# EAGLE board uNimbus_board_2_v1_2 (EAGLE 9.3.1)
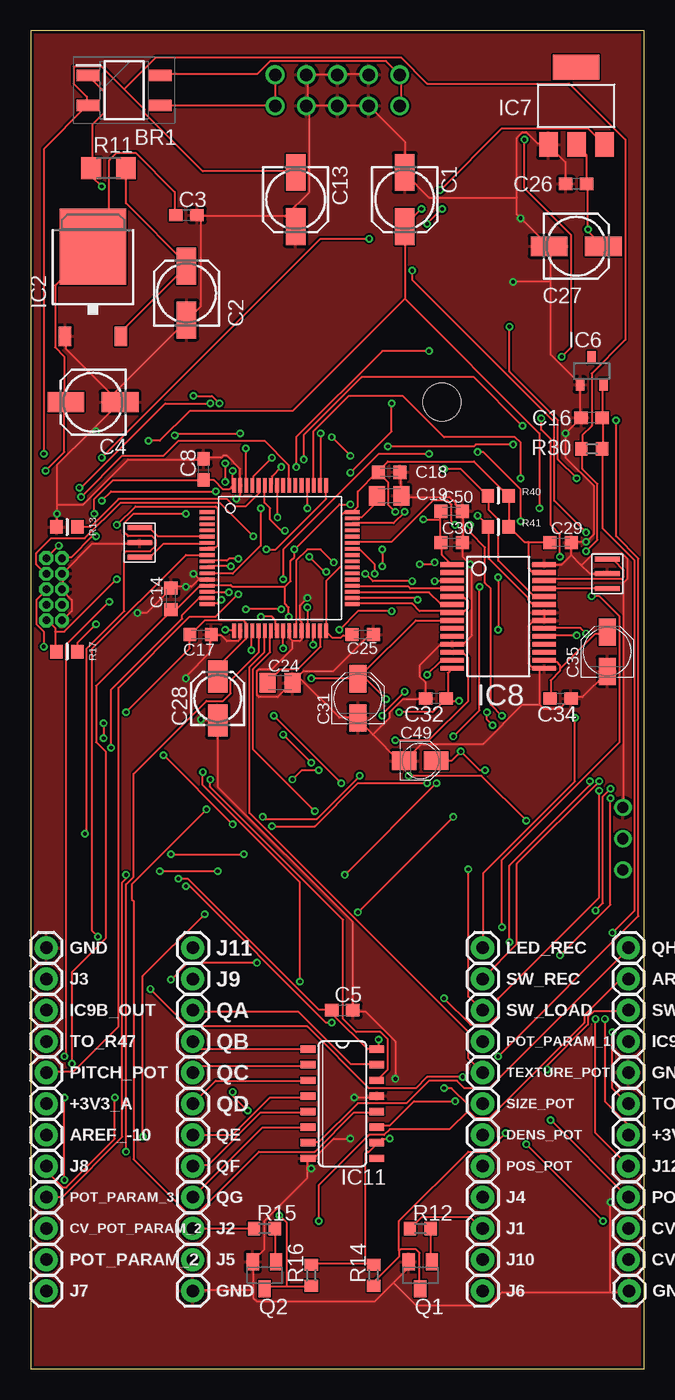
[diagram p4: board, top side]
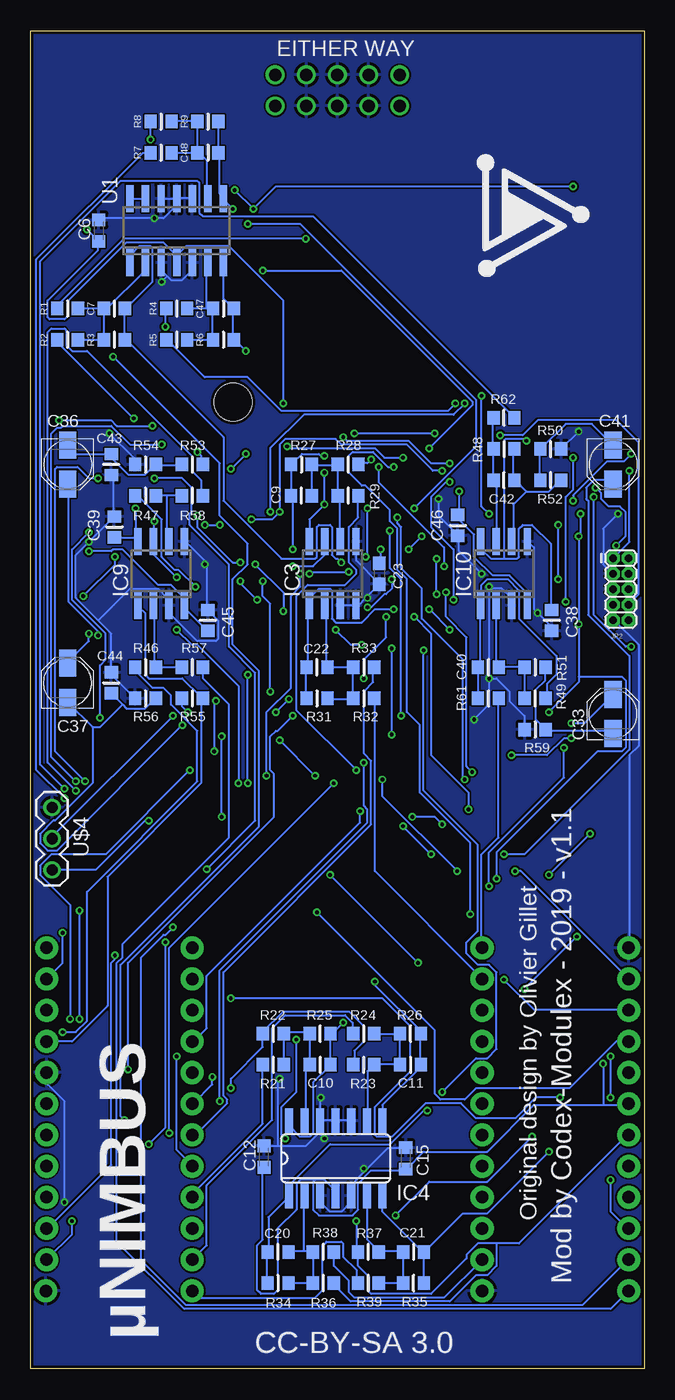
[diagram p5: board, bottom side, seen from below]

Size 50 x 109 mm. Coordinates in mm from the lower left corner, seen from the top.
Outline: 0,0 50,0 50,109 0,109 0,0
Copper layers (1*16): Top 0.035mm / dielectric 1.5mm / Bottom 0.035mm
Design rules "dirt_cheap_dirty_boards.v1.1": minimum track width 6mil, minimum drill 12mil, track to track 6mil, track to pad 6mil, pad to pad 6mil, via to via 6mil, smd to smd 0mil, copper to edge 10mil, drill to drill 10mil, minimum pad ring 10mil, minimum via ring 6mil, stop-mask expansion 2mil, vias tented up to drill 25mil, thermal gap 10mil
Holes 3.1 mm at 33.51,78.74

## Footprints (pad centres in the part's own frame; a part is rotated, then mirrored left to right if it is on the bottom)
SOP245P670X290-4N = smd 1.925 x 0.95: 1 -2.912,1.225; 2 -2.912,-1.225; 3 2.912,-1.225; 4 2.912,1.225
153CLV-0505 = smd 3 x 1.6: + 2.2,0; - -2.2,0
C0603 = smd 1.1 x 1: 1 -0.85,0; 2 0.85,0
C0603K = smd 1.05 x 1.08: 1 -0.875,0; 2 0.875,0
PARTS_AMAN_RESISTOR_0603 = smd 1 x 1.1: 1 -0.85,0; 2 0.85,0
C0805K = smd 1.3 x 1.6: 1 -1,0; 2 1,0
153CLV-0405 = smd 2.6 x 1.6: + 1.8,0; - -1.8,0
PANASONIC_B = smd 2.2 x 1.4: + 1.6,0; - -1.6,0
PANASONIC_A = smd 2 x 1.5: + 1.3,0; - -1.3,0
TO252 = smd 1 x 1.6: 1 -2.28,-4.8; 2 2.28,-4.8 | smd 5.4 x 6.2: 3 0,2.5
SO08 = smd 0.6 x 2.2: 1 -1.905,-2.6; 2 -0.635,-2.6; 3 0.635,-2.6; 4 1.905,-2.6; 5 1.905,2.6; 6 0.635,2.6; 7 -0.635,2.6; 8 -1.905,2.6
SO14 = smd 0.66 x 2.032: 1 -3.81,-3.073; 2 -2.54,-3.073; 3 -1.27,-3.073; 4 0,-3.073; 5 1.27,-3.073; 6 2.54,-3.073; 7 3.81,-3.073; 8 3.81,3.073; 9 2.54,3.073; 10 1.27,3.073; 11 0,3.073; 12 -1.27,3.073; 13 -2.54,3.073; 14 -3.81,3.073
TQFP-10X10-64 = smd 1.2 x 0.3: 1 -5.936,3.75; 2 -5.936,3.25; 3 -5.936,2.75; 4 -5.936,2.25; 5 -5.936,1.75; 6 -5.936,1.25; 7 -5.936,0.75; 8 -5.936,0.25; 9 -5.936,-0.25; 10 -5.936,-0.75; 11 -5.936,-1.25; 12 -5.936,-1.75; 13 -5.936,-2.25; 14 -5.936,-2.75; 15 -5.936,-3.25; 16 -5.936,-3.75; 33 5.886,-3.75; 34 5.886,-3.25; 35 5.886,-2.75; 36 5.886,-2.25; 37 5.886,-1.75; 38 5.886,-1.25; 39 5.886,-0.75; 40 5.886,-0.25; 41 5.886,0.25; 42 5.886,0.75; 43 5.886,1.25; 44 5.886,1.75; 45 5.886,2.25; 46 5.886,2.75; 47 5.886,3.25; 48 5.886,3.75 | smd 0.3 x 1.2: 17 -3.75,-5.911; 18 -3.25,-5.911; 19 -2.75,-5.911; 20 -2.25,-5.911; 21 -1.75,-5.911; 22 -1.25,-5.911; 23 -0.75,-5.911; 24 -0.25,-5.911; 25 0.25,-5.911; 26 0.75,-5.911; 27 1.25,-5.911; 28 1.75,-5.911; 29 2.25,-5.911; 30 2.75,-5.911; 31 3.25,-5.911; 32 3.75,-5.911; 49 3.75,5.936; 50 3.25,5.936; 51 2.75,5.936; 52 2.25,5.936; 53 1.75,5.936; 54 1.25,5.936; 55 0.75,5.936; 56 0.25,5.936; 57 -0.25,5.936; 58 -0.75,5.936; 59 -1.25,5.936; 60 -1.75,5.936; 61 -2.25,5.936; 62 -2.75,5.936; 63 -3.25,5.936; 64 -3.75,5.936
DBZ_R-PDSO-G3 = smd 0.7 x 1: 1 -0.95,-1.1; 2 0.95,-1.1; 3 0,1.1
SOT223 = smd 1.499 x 2.007: 1 -2.261,-3.15; 2 0.025,-3.15; 3 2.311,-3.15 | smd 3.81 x 2.007: 4 0,3.15
SSOP28 = smd 0.381 x 1.905: 1 -4.55,-3.752; 2 -3.9,-3.752; 3 -3.25,-3.752; 4 -2.6,-3.752; 5 -1.95,-3.752; 6 -1.3,-3.752; 7 -0.65,-3.752; 8 0,-3.752; 9 0.65,-3.752; 10 1.3,-3.752; 11 1.95,-3.752; 12 2.6,-3.752; 13 3.25,-3.752; 14 3.9,-3.752; 15 3.9,3.752; 16 3.25,3.752; 17 2.6,3.752; 18 1.95,3.752; 19 1.3,3.752; 20 0.65,3.752; 21 0,3.752; 22 -0.65,3.752; 23 -1.3,3.752; 24 -1.95,3.752; 25 -2.6,3.752; 26 -3.25,3.752; 27 -3.9,3.752; 28 -4.55,3.752
SO16 = smd 0.6 x 1.2: 1 -4.445,-2.8; 2 -3.175,-2.8; 3 -1.905,-2.8; 4 -0.635,-2.8; 5 0.635,-2.8; 6 1.905,-2.8; 7 3.175,-2.8; 8 4.445,-2.8; 9 4.445,2.8; 10 3.175,2.8; 11 1.905,2.8; 12 0.635,2.8; 13 -0.635,2.8; 14 -1.905,2.8; 15 -3.175,2.8; 16 -4.445,2.8
PARTS_AMAN_1X01 = drill 1.016 pad 1.88: 1 0,0
2X5-1.27 = drill 0.61 pad 1.067 octagon: 1 -1.27,3.81; 2 0,3.81; 3 -1.27,2.54; 4 0,2.54; 5 -1.27,1.27; 6 0,1.27; 7 -1.27,0; 8 0,0; 9 -1.27,-1.27; 10 0,-1.27
SOT23-BEC = smd 1 x 1.4: B -0.95,-1.1; C 0,1.1; E 0.95,-1.1
CRYSTAL_SMALLER = smd 0.4 x 2: GND 0,0; X1 -1.2,0; X2 1.2,0
R1206 = smd 1.6 x 1.803: 1 -1.422,0; 2 1.422,0
R0603 = smd 1 x 1.1: 1 -0.85,0; 2 0.85,0
SO14' = smd 0.6 x 2.2: 1 -3.81,-2.6; 2 -2.54,-2.6; 3 -1.27,-2.6; 4 0,-2.6; 5 1.27,-2.6; 6 2.54,-2.6; 7 3.81,-2.6; 8 3.81,2.6; 9 2.54,2.6; 10 1.27,2.6; 11 0,2.6; 12 -1.27,2.6; 13 -2.54,2.6; 14 -3.81,2.6
EURO_POWER2 = drill 1.016: GND1 -1.27,2.54; GND2 1.27,2.54; GND3 -1.27,0; GND4 1.27,0; GND5 -1.27,-2.54; GND6 1.27,-2.54; V+ -1.27,5.08; V++ 1.27,5.08; V- -1.27,-5.08; V-- 1.27,-5.08
1X3_SMALL = drill 0.9: 1 -2.54,0; 2 0,0; 3 2.54,0

## Placement (x,y rotation side)
BR1  MB1S  [SOP245P670X290-4N]  7.62,104.14 0 top
C1  47u  [153CLV-0505]  30.48,95.25 270 top
C2  47u  [153CLV-0505]  12.7,87.63 90 top
C3  100n  [C0603]  12.7,93.98 0 top
C4  47u  [153CLV-0505]  5.08,78.74 180 top
C5  100n  [C0603]  25.4,29.21 0 top
C6  100n  [C0603K]  44.45,92.71 90 bottom
C7  1n  [PARTS_AMAN_RESISTOR_0603]  43.18,86.36 0 bottom
C8  100n  [C0603]  14.1,73.28 90 top
C9  1n  [PARTS_AMAN_RESISTOR_0603]  27.94,71.12 180 bottom
C10  1n  [PARTS_AMAN_RESISTOR_0603]  26.42,24.77 0 bottom
C11  1n  [PARTS_AMAN_RESISTOR_0603]  19.05,24.77 0 bottom
C12  1u  [C0603K]  30.99,17.27 90 bottom
C13  47u  [153CLV-0505]  21.59,95.25 270 top
C14  100n  [C0603K]  11.43,62.74 90 top
C15  100n  [C0603K]  19.43,17.14 90 bottom
C16  100n  [C0603]  45.72,77.47 180 top
C17  100n  [C0603K]  13.84,59.82 0 top
C18  100n  [C0603K]  29.21,73.03 0 top
C19  2.2u  [C0805K]  29.21,71.12 0 top
C20  1n  [PARTS_AMAN_RESISTOR_0603]  29.84,9.53 180 bottom
C21  1n  [PARTS_AMAN_RESISTOR_0603]  18.8,9.53 0 bottom
C22  1n  [PARTS_AMAN_RESISTOR_0603]  26.67,57.15 180 bottom
C23  100n  [C0603]  21.59,64.77 270 bottom
C24  2.2u  [C0805K]  20.32,55.88 0 top
C25  100n  [C0603K]  27.05,59.82 0 top
C26  100n  [C0603]  44.45,96.52 180 top
C27  47u  [153CLV-0505]  44.45,91.44 0 top
C28  10u  [153CLV-0405]  15.24,54.61 90 top
C29  100n  [C0603K]  43.18,67.31 0 top
C30  100n  [C0603K]  34.29,67.31 0 top
C31  10u  [PANASONIC_B]  26.67,54.61 90 top
C32  100n  [C0603]  33.02,54.61 180 top
C33  10u  [PANASONIC_B]  2.54,53.34 90 bottom
C34  100n  [C0603]  43.18,54.61 0 top
C35  10u  [PANASONIC_B]  46.99,58.42 90 top
C36  10u  [PANASONIC_B]  46.99,73.66 270 bottom
C37  10u  [PANASONIC_B]  46.99,55.88 90 bottom
C38  100n  [PARTS_AMAN_RESISTOR_0603]  7.53,60.96 270 bottom
C39  100n  [PARTS_AMAN_RESISTOR_0603]  43.18,68.58 90 bottom
C40  18p  [PARTS_AMAN_RESISTOR_0603]  12.7,57.15 180 bottom
C41  10u  [PANASONIC_B]  2.54,73.66 270 bottom
C42  18p  [PARTS_AMAN_RESISTOR_0603]  11.43,72.39 180 bottom
C43  220p  [PARTS_AMAN_RESISTOR_0603]  43.43,73.66 270 bottom
C44  220p  [PARTS_AMAN_RESISTOR_0603]  43.43,55.88 90 bottom
C45  100n  [PARTS_AMAN_RESISTOR_0603]  35.56,60.96 270 bottom
C46  100n  [PARTS_AMAN_RESISTOR_0603]  15.2,68.71 90 bottom
C47  1n  [PARTS_AMAN_RESISTOR_0603]  34.29,86.36 0 bottom
C48  1n  [PARTS_AMAN_RESISTOR_0603]  35.56,99.06 0 bottom
C49  10u  [PANASONIC_A]  31.75,49.53 0 top
C50  1u  [C0603K]  34.29,69.85 0 top
IC2  LM1117-3.3  [TO252]  5.08,88.9 0 top
IC3  MCP6002  [SO08]  25.4,64.77 0 bottom
IC4  MCP6004  [SO14]  25.15,17.14 0 bottom
IC5  STM32F405RGT6  [TQFP-10X10-64]  20.32,66.04 0 top
IC6  LM4040B10  [DBZ_R-PDSO-G3]  45.72,81.28 0 top
IC7  LM1117-3.3  [SOT223]  44.45,102.87 0 top
IC8  WM8731  [SSOP28]  38.1,60.96 270 top
IC9  TL072D  [SO08]  39.37,64.77 0 bottom
IC10  TL072D  [SO08]  11.43,64.77 0 bottom
IC11  74LS595D  [SO16]  25.4,21.59 270 top
JP1  TO_R46  [PARTS_AMAN_1X01]  48.71,21.59 0 top
JP2  M05X2MINIJTAG  [2X5-1.27]  1.27,62.23 0 bottom
JP3  TO_R47  [PARTS_AMAN_1X01]  1.27,26.67 0 top
JP4  J8  [PARTS_AMAN_1X01]  1.27,16.51 0 top
JP5  J7  [PARTS_AMAN_1X01]  1.27,6.35 0 top
JP6  J3  [PARTS_AMAN_1X01]  1.27,31.75 0 top
JP7  J9  [PARTS_AMAN_1X01]  13.21,31.75 0 top
JP8  J5  [PARTS_AMAN_1X01]  13.21,8.89 0 top
JP9  J4  [PARTS_AMAN_1X01]  36.83,13.97 0 top
JP10  J6  [PARTS_AMAN_1X01]  36.83,6.35 0 top
JP11  J10  [PARTS_AMAN_1X01]  36.83,8.89 0 top
JP12  J12  [PARTS_AMAN_1X01]  48.71,16.51 0 top
JP13  J11  [PARTS_AMAN_1X01]  13.21,34.29 0 top
JP14  AREF_-10  [PARTS_AMAN_1X01]  1.27,19.05 0 top
JP15  POS_POT  [PARTS_AMAN_1X01]  36.83,16.51 0 top
JP16  DENS_POT  [PARTS_AMAN_1X01]  36.83,19.05 0 top
JP17  IC9A_OUT  [PARTS_AMAN_1X01]  48.71,26.67 0 top
JP18  IC9B_OUT  [PARTS_AMAN_1X01]  1.27,29.21 0 top
JP19  J1  [PARTS_AMAN_1X01]  36.83,11.43 0 top
JP20  J2  [PARTS_AMAN_1X01]  13.21,11.43 0 top
JP21  LED_REC  [PARTS_AMAN_1X01]  36.83,34.29 0 top
JP22  SW_REC  [PARTS_AMAN_1X01]  36.83,31.75 0 top
JP23  QA  [PARTS_AMAN_1X01]  13.21,29.21 0 top
JP24  QB  [PARTS_AMAN_1X01]  13.21,26.67 0 top
JP25  QC  [PARTS_AMAN_1X01]  13.21,24.13 0 top
JP26  QD  [PARTS_AMAN_1X01]  13.21,21.59 0 top
JP27  QE  [PARTS_AMAN_1X01]  13.21,19.05 0 top
JP28  QF  [PARTS_AMAN_1X01]  13.21,16.51 0 top
JP29  QG  [PARTS_AMAN_1X01]  13.21,13.97 0 top
JP30  QH  [PARTS_AMAN_1X01]  48.71,34.29 0 top
JP31  SIZE_POT  [PARTS_AMAN_1X01]  36.83,21.59 0 top
JP32  TEXTURE_POT  [PARTS_AMAN_1X01]  36.83,24.13 0 top
JP33  PITCH_POT  [PARTS_AMAN_1X01]  1.27,24.13 0 top
JP34  POT_PARAM_1  [PARTS_AMAN_1X01]  36.83,26.67 0 top
JP35  SW_MODE  [PARTS_AMAN_1X01]  48.71,29.21 0 top
JP36  SW_LOAD  [PARTS_AMAN_1X01]  36.83,29.21 0 top
JP37  +3V3_A  [PARTS_AMAN_1X01]  48.71,19.05 0 top
JP38  GND  [PARTS_AMAN_1X01]  48.71,24.13 0 top
JP39  GND  [PARTS_AMAN_1X01]  13.21,6.35 0 top
JP40  AREF_-10  [PARTS_AMAN_1X01]  48.71,31.75 0 top
JP41  +3V3_A  [PARTS_AMAN_1X01]  1.27,21.59 0 top
JP42  GND  [PARTS_AMAN_1X01]  1.27,34.29 0 top
JP43  GND  [PARTS_AMAN_1X01]  48.77,6.35 0 top
JP45  POT_PARAM_2  [PARTS_AMAN_1X01]  1.27,8.89 0 top
JP46  CV_POT_PARAM_2  [PARTS_AMAN_1X01]  1.27,11.43 0 top
JP47  POT_PARAM_3  [PARTS_AMAN_1X01]  1.27,13.97 0 top
JP48  CV_POT_PARAM_3  [PARTS_AMAN_1X01]  48.71,8.89 0 top
JP49  CV_POT_PARAM_4  [PARTS_AMAN_1X01]  48.71,11.43 0 top
JP50  POT_PARAM_4  [PARTS_AMAN_1X01]  48.71,13.97 0 top
Q1  MMBT3904  [SOT23-BEC]  31.75,7.62 180 top
Q2  MMBT3904  [SOT23-BEC]  19.05,7.62 180 top
Q3  8MHz  [CRYSTAL_SMALLER]  8.89,67.31 90 top
Q4  12.288MHz  [CRYSTAL_SMALLER]  46.99,64.77 90 top
R1  100k  [PARTS_AMAN_RESISTOR_0603]  46.99,86.36 0 bottom
R2  200k  [PARTS_AMAN_RESISTOR_0603]  46.99,83.82 0 bottom
R3  66.5k  [PARTS_AMAN_RESISTOR_0603]  43.18,83.82 0 bottom
R4  100k  [PARTS_AMAN_RESISTOR_0603]  38.1,86.36 0 bottom
R5  200k  [PARTS_AMAN_RESISTOR_0603]  38.1,83.82 0 bottom
R6  66.5k  [PARTS_AMAN_RESISTOR_0603]  34.29,83.82 0 bottom
R7  100k  [PARTS_AMAN_RESISTOR_0603]  39.37,99.06 0 bottom
R8  200k  [PARTS_AMAN_RESISTOR_0603]  39.37,101.6 0 bottom
R9  66.5k  [PARTS_AMAN_RESISTOR_0603]  35.56,101.6 0 bottom
R11  4.7  [R1206]  6.35,97.79 0 top
R12  100k  [R0603]  31.75,11.43 0 top
R13  10k  [PARTS_AMAN_RESISTOR_0603]  2.96,68.58 0 top
R14  10k  [R0603]  27.94,7.62 90 top
R15  100k  [R0603]  19.05,11.43 0 top
R16  10k  [R0603]  22.86,7.62 90 top
R17  10k  [PARTS_AMAN_RESISTOR_0603]  2.96,58.42 0 top
R21  100k  [PARTS_AMAN_RESISTOR_0603]  30.23,24.77 180 bottom
R22  200k  [PARTS_AMAN_RESISTOR_0603]  30.23,27.3 180 bottom
R23  200k  [PARTS_AMAN_RESISTOR_0603]  22.86,24.77 180 bottom
R24  100k  [PARTS_AMAN_RESISTOR_0603]  22.86,27.3 180 bottom
R25  33k  [PARTS_AMAN_RESISTOR_0603]  26.42,27.3 180 bottom
R26  33k  [PARTS_AMAN_RESISTOR_0603]  19.05,27.3 180 bottom
R27  66.5k  [PARTS_AMAN_RESISTOR_0603]  27.94,73.66 0 bottom
R28  200k  [PARTS_AMAN_RESISTOR_0603]  24.13,73.66 0 bottom
R29  100k  [PARTS_AMAN_RESISTOR_0603]  24.13,71.12 0 bottom
R30  470  [R0603]  45.72,74.93 0 top
R31  66.5k  [PARTS_AMAN_RESISTOR_0603]  26.67,54.61 0 bottom
R32  100k  [PARTS_AMAN_RESISTOR_0603]  22.86,54.61 0 bottom
R33  200k  [PARTS_AMAN_RESISTOR_0603]  22.86,57.15 0 bottom
R34  47k  [PARTS_AMAN_RESISTOR_0603]  29.84,6.99 0 bottom
R35  33k  [PARTS_AMAN_RESISTOR_0603]  18.8,6.99 180 bottom
R36  180k  [PARTS_AMAN_RESISTOR_0603]  26.16,6.99 0 bottom
R37  200k  [PARTS_AMAN_RESISTOR_0603]  22.48,9.53 180 bottom
R38  100k  [PARTS_AMAN_RESISTOR_0603]  26.16,9.53 0 bottom
R39  100k  [PARTS_AMAN_RESISTOR_0603]  22.48,6.99 180 bottom
R40  2.2k  [PARTS_AMAN_RESISTOR_0603]  38.1,71.12 0 top
R41  2.2k  [PARTS_AMAN_RESISTOR_0603]  38.1,68.58 0 top
R46  3.3k  [PARTS_AMAN_RESISTOR_0603]  40.64,57.15 0 bottom
R47  3.3k  [PARTS_AMAN_RESISTOR_0603]  40.64,71.12 0 bottom
R48  39k  [PARTS_AMAN_RESISTOR_0603]  11.43,74.93 0 bottom
R49  39k  [PARTS_AMAN_RESISTOR_0603]  8.89,54.61 180 bottom
R50  39k  [PARTS_AMAN_RESISTOR_0603]  7.62,74.93 180 bottom
R51  5.6k  [PARTS_AMAN_RESISTOR_0603]  8.89,57.15 0 bottom
R52  5.6k  [PARTS_AMAN_RESISTOR_0603]  7.62,72.39 180 bottom
R53  5.6k  [PARTS_AMAN_RESISTOR_0603]  36.83,73.66 0 bottom
R54  5.6k  [PARTS_AMAN_RESISTOR_0603]  40.64,73.66 0 bottom
R55  5.6k  [PARTS_AMAN_RESISTOR_0603]  36.83,54.61 0 bottom
R56  5.6k  [PARTS_AMAN_RESISTOR_0603]  40.64,54.61 0 bottom
R57  22k  [PARTS_AMAN_RESISTOR_0603]  36.83,57.15 0 bottom
R58  22k  [PARTS_AMAN_RESISTOR_0603]  36.83,71.12 0 bottom
R59  39k  [PARTS_AMAN_RESISTOR_0603]  8.89,52.07 0 bottom
R61  1.0k  [PARTS_AMAN_RESISTOR_0603]  12.7,54.61 180 bottom
R62  1.0k  [PARTS_AMAN_RESISTOR_0603]  11.43,77.47 180 bottom
U1  MCP6004_SMD  [SO14']  38.1,92.71 0 bottom
U$2  EURO_POWER2  [EURO_POWER2]  25,104.14 90 top
U$4  1X3_SMALL  [1X3_SMALL]  48.26,43.18 90 bottom

## Tracks (layer width: path | path; a pad name or v marks a point on that pad's centre or on a via)
+3V3  (via drill 0.3)
  Top 0.152: 40.54,67.36 40.23,67.36 39.01,68.58 | 40.54,67.36 42.22,67.36 C29.1 | 39.01,68.58 39.01,71.02 R40.2 38.86,71.17 36.12,73.91 29.11,73.91 28.35,73.15 C18.1 | 39.01,68.58 R41.2 | 40.54,67.36 40.54,65.23 40.84,64.92 41.76,64.92 IC8.27 | IC8.1 34.29,65.53 33.53,66.29 33.53,67.21 C30.1 33.38,67.36 33.38,69.19 | 33.38,69.19 33.38,69.8 C50.1 | C25.1 26.06,59.74 25.45,59.74 25.3,59.59 24.54,59.59 24.08,60.05 IC5.32 24.08,60.2 24.08,64.16 25.3,65.38 25.3,69.49 25.6,69.8 26.06,69.8 IC5.48 26.67,70.26 26.67,71.48 28.19,73 C18.1 | v32,69.19 33.38,69.19 | v29.72,69.8 29.11,70.41 29.11,72.24 28.35,73 C18.1 | C3.1 11.73,94.03 11.73,95.86 8.53,99.06 7.01,99.06 6.4,98.45 6.4,92.66 5.18,91.44 IC2.3 5.03,91.29 1.98,88.24 1.98,83.21 2.74,82.45 2.74,78.79 C4.+ 2.74,78.64 2.74,74.68 v1.22,73.15 | 27.28,8.53 27.89,8.53 R14.2 | 27.28,8.53 22.86,8.53 R16.2 | 27.28,8.53 27.28,17.53 27.43,17.68 27.58,17.68 28.19,18.29 IC11.10 28.35,18.44 28.65,18.75 v29.26,18.75 | v28.35,26.82 28.35,26.06 IC11.16 28.19,26.06 27.43,26.06 24.69,28.8 24.69,29.11 C5.1 24.54,29.26 23.47,29.26 12.8,39.93 v12.04,39.93 | C28.+ 15.24,57.15 17.53,59.44 17.53,60.05 IC5.19 17.53,60.2 17.53,60.81 17.37,60.96 14.17,60.96 13.11,59.89 C17.1 12.95,59.74 12.95,58.67 v7.77,53.49 | R17.2 3.81,59.13 v5.33,60.66 | v5.33,67.82 5.03,67.82 3.35,66.14 2.59,66.14 JP2.1 | v5.18,69.65 5.18,70.87 6.71,72.39 14.02,72.39 C8.1 14.17,72.39 14.94,72.39 15.7,71.63 16.15,71.63 16.46,71.93 IC5.64 16.46,72.08 v16.46,73.15
  Bottom 0.152: v32,69.19 30.33,69.19 v29.72,69.8 29.72,75.29 29.26,75.74 25.15,75.74 24.69,75.29 19.36,75.29 17.22,73.15 v16.46,73.15 | v28.35,26.82 28.35,22.55 29.57,21.34 29.57,19.05 v29.26,18.75 | v5.18,69.65 5.18,67.97 v5.33,67.82 v5.33,60.66 5.33,56.39 | v7.77,53.49 5.33,55.93 5.33,56.39 | v12.04,39.93 12.04,42.06 3.81,50.29 1.83,50.29 1.52,50.6 1.52,56.08 1.83,56.39 5.33,56.39 | v1.22,73.15 1.22,67.36 JP2.1
+3V3_A  (via drill 0.3)
  Top 0.152: IC7.2 44.5,99.67 45.26,98.91 45.26,96.62 C26.1 45.41,96.47 v45.41,92.81 45.41,92.66 46.63,91.44 C27.+ | 20.73,63.7 21.18,64.16 21.18,65.84 21.49,66.14 v21.49,66.75 25.15,70.41 v26.06,70.41 | 20.73,63.7 16.46,63.7 16.31,63.86 14.48,63.86 IC5.13 14.33,63.7 13.72,63.7 11.89,61.87 11.43,61.87 C14.1 11.43,61.72 5.33,55.63 5.33,51.05 6.1,50.29 6.1,35.05 3.35,32.31 v3.35,24.84 | IC8.8 31.39,60.96 26.98,56.54 | 26.67,56.24 26.98,56.54 | C32.1 33.98,54.71 33.98,56.69 34.29,57 IC8.14 | C49.+ 34.29,49.53 v35.05,50.29 36.58,48.77 v37.03,48.77 | v34.9,54.41 34.14,54.41 33.98,54.56 C32.1 | v46.79,28.5 46.79,21.79 48.62,19.96 48.62,19.05 JP37.1 | v28.96,54.56 26.98,56.54 | v30.02,53.49 32.77,53.49 33.83,54.56 C32.1 | 26.98,56.54 C31.+ 26.67,56.24 | 20.73,63.7 20.73,62.33 21.03,62.03 v21.03,61.27 | 26.67,56.24 v22.86,56.24 | v29.41,78.64 29.41,76.35 v26.06,73
  Bottom 0.152: 26.82,15.39 26.98,15.24 26.98,12.95 26.52,12.5 23.77,12.5 23.32,12.95 23.32,15.09 22.25,16.15 19.51,16.15 C15.1 19.36,16.31 17.98,17.68 12.8,17.68 8.99,21.49 3.35,21.49 | 26.82,15.39 26.06,15.39 25.15,14.48 IC4.4 | 26.82,15.39 28.04,15.39 28.35,15.09 28.35,12.95 29.87,11.43 29.87,6.4 30.18,6.1 31.24,6.1 31.55,6.4 31.55,10.06 31.09,10.52 31.09,16.31 C12.1 | 3.35,21.49 1.37,21.49 JP41.1 | 38.1,90.68 39.17,91.75 42.22,91.75 46.94,87.02 46.94,85.8 47.24,85.5 48.46,85.5 48.62,85.65 48.62,87.02 44.5,91.14 44.5,91.75 C6.1 44.5,91.9 v45.41,92.81 | 38.1,90.68 U1.4 38.1,90.22 | v21.49,66.75 21.49,65.68 C23.1 | IC3.8 27.28,67.51 27.28,69.19 v26.06,70.41 v26.06,73 | v35.05,50.29 35.05,54.25 v34.9,54.41 | v46.79,28.5 46.79,37.8 49.23,40.23 49.23,41 48.31,41.91 43.89,41.91 v37.03,48.77 | v30.02,53.49 v28.96,54.56 | v21.03,61.27 21.03,59.59 22.86,57.76 v22.86,56.24 | 38.1,90.68 37.34,91.44 33.83,91.44 29.41,87.02 v29.41,78.64 | v3.35,24.84 3.35,21.49
AREF_-10  (via drill 0.3)
  Top 0.152: IC6.2 46.63,80.16 46.63,77.57 C16.1 46.63,77.42 46.63,74.98 R30.2 46.63,74.83 46.63,68.43 49.23,65.84 49.23,37.34 v47.4,35.51 | v33.68,22.86 34.29,22.86 35.66,21.49 35.66,21.03 | 35.66,21.03 36.27,20.42 37.34,20.42 45.11,28.19 45.11,28.8 48.01,31.7 48.62,31.7 JP40.1 | v23.47,12.04 23.47,14.94 27.58,19.05 28.8,19.05 29.26,19.51 34.14,19.51 35.66,21.03
  Bottom 0.152: 12.04,10.21 10.21,10.21 1.37,19.05 JP14.1 | 12.04,10.21 13.56,10.21 14.48,9.3 14.48,8.99 17.37,6.1 22.25,6.1 22.4,6.25 22.4,7.47 23.32,8.38 23.32,9.45 R37.2 23.47,9.6 v23.47,12.04 | 12.04,10.21 12.04,8.38 12.8,7.62 13.72,7.62 15.85,5.49 23.93,5.49 25.3,6.86 R36.2 | R23.2 23.62,24.84 23.62,25.91 22.86,26.67 22.86,27.89 24.08,29.11 29.41,29.11 31.09,27.43 R22.2 31.09,27.28 31.09,26.21 33.68,23.62 v33.68,22.86 | v47.4,35.51 47.4,33.07 48.62,31.85 JP40.1
BLEND_CV  (via drill 0.3)
  Top 0.152: v7.77,17.68 7.77,39.47 8.38,40.08 8.38,48.46 14.33,54.41 15.7,54.41 16.31,55.02 16.31,56.08 18.59,58.37 18.59,60.05 IC5.21
  Bottom 0.152: 17.98,9.45 17.98,7.01 R35.1 | v7.77,17.68 12.8,12.65 14.78,12.65 17.83,9.6 C21.2 17.98,9.45 | IC4.7 21.34,12.8 17.98,9.45
BOOT_FLASH
  Top 0.152: R13.2 4.88,68.58 7.16,70.87 16,70.87 16.61,70.26 17.53,70.26 18.59,71.32 18.59,71.93 IC5.60
DENSITY_CV  (via drill 0.3)
  Top 0.152: v15.85,60.2 16.46,60.2 IC5.17 | v20.42,61.87 v17.53,61.87
  Bottom 0.152: R31.1 27.58,54.71 27.58,57.15 C22.2 27.43,57.15 27.43,62.03 IC3.1 27.28,62.18 27.28,62.79 26.52,63.55 25.6,63.55 25.45,63.4 25.45,61.11 25.15,60.81 23.01,60.81 21.95,61.87 v20.42,61.87 | v17.53,61.87 v15.85,60.2
GND  (via drill 0.3)
  Top 0.152: 21.34,59.28 21.18,59.44 21.18,60.05 IC5.26 | 21.34,59.28 21.95,59.28 22.1,59.44 22.1,60.05 IC5.28 22.1,60.2 22.1,60.81 21.95,60.96 21.95,62.18 v22.55,62.79 | 21.79,56.39 21.34,55.93 C24.2 | 21.79,56.39 22.25,56.84 24.69,56.84 27.58,59.74 27.89,59.74 C25.2 | 21.34,59.28 21.34,58.67 19.66,57 18.59,57 18.44,56.84 18.44,54.86 18.59,54.71 20.12,54.71 21.18,55.78 C24.2 | C35.- 46.94,56.69 44.96,54.71 44.04,54.71 C34.2 43.89,54.56 43.13,53.8 41.76,53.8 41.45,54.1 | 41.45,57.15 40.84,57.15 40.54,57.45 40.54,60.5 41,60.96 IC8.21 41.91,60.96 41.91,61.57 IC8.22 | 41.45,57.15 41.76,57.15 IC8.15 41.45,57.15 | 41.45,57.15 41.45,54.1 | C18.2 30.18,73 30.18,71.17 C19.2 30.33,71.02 34.14,71.02 34.59,70.56 34.59,70.41 35.05,69.95 C50.2 35.2,69.8 35.2,67.36 C30.2 35.2,67.21 35.2,66.14 v35.81,65.53 35.97,65.38 35.97,59.74 35.36,59.13 34.44,59.13 IC8.11 34.29,58.98 33.38,58.98 31.7,57.3 31.7,56.39 32.16,55.93 32.16,54.71 C32.2 32.16,54.56 30.33,54.56 29.26,53.49 29.26,53.03 27.89,51.66 | 27.89,51.66 26.67,52.88 C31.- 26.67,53.03 25.15,53.03 21.79,56.39 | 27.89,51.66 30.02,49.53 C49.- 30.48,49.53 31.85,50.9 36.88,50.9 40.08,54.1 41.45,54.1 | 21.79,56.39 C24.2 | 44.04,66.29 44.04,67.21 C29.2 44.2,67.36 v45.26,67.36 45.87,67.97 45.87,71.93 43.59,74.22 v43.59,76.2 44.81,77.42 C16.2 44.81,77.57 44.81,80.16 IC6.1 44.65,80.31 42.37,82.6 42.37,88.54 | 44.04,66.29 43.28,65.53 41.91,65.53 IC8.28 | Q4.GND 45.57,64.77 44.81,65.53 | 44.04,66.29 44.81,65.53 | 44.81,65.53 44.96,65.53 45.87,66.45 48.16,66.45 48.62,65.99 48.62,64.31 48.31,64.01 48.31,45.72 U$4.3 | C26.2 43.59,96.62 43.59,98.3 42.22,99.67 IC7.1 42.06,99.82 41.3,99.82 40.39,100.74 40.08,100.74 39.62,100.28 39.62,95.4
  Top 0.152: 42.37,88.54 42.37,91.44 C27.- 42.22,91.44 v39.93,93.73 39.62,94.03 39.62,95.4 | 42.37,88.54 v39.32,88.54 | v26.36,22.1 28.19,22.1 IC11.13 | 22.55,16.31 22.55,15.54 19.05,12.04 19.05,9.75 18.14,8.84 Q2.E 18.14,8.69 18.14,6.4 | 22.55,16.31 22.55,17.07 IC11.8 22.71,17.22 23.16,17.22 24.69,18.75 v26.06,18.75 | 29.57,7.01 28.04,5.49 18.44,5.49 18.14,5.79 18.14,6.4 | 29.57,7.01 30.79,8.23 30.79,8.69 Q1.E | 18.14,6.4 13.26,6.4 JP39.1 | 47.24,6.25 38.41,6.25 37.34,5.18 31.39,5.18 29.57,7.01 | 47.24,6.25 48.77,6.25 JP43.1 | 47.24,6.25 v47.24,13.56 | 22.55,16.31 v22.86,16.31 | JP2.9 2.59,60.96 3.35,61.72 3.35,62.64 2.59,63.4 JP2.5 2.59,63.55 2.59,64.77 | 2.59,64.77 5.03,67.21 8.84,67.21 Q3.GND | 2.59,64.77 JP2.3 | 13.72,64.31 13.11,63.7 v12.65,63.7 11.43,63.7 C14.2 11.43,63.55 9.45,61.57 v8.69,61.57 | 13.72,64.31 14.33,64.31 IC5.12 | 13.72,64.31 v13.26,64.77 | IC5.18 17.07,60.05 17.07,59.44 16.92,59.28 16,59.28 15.54,59.74 14.78,59.74 C17.2 14.63,59.74 14.63,58.37 12.65,56.39 v12.65,56.24 | U$2.GND6 27.43,105.46 25.15,105.46 U$2.GND4 24.99,105.46 22.55,105.46 U$2.GND2 22.55,105.31 22.55,102.87 | 22.71,102.87 U$2.GND3 U$2.GND5 27.58,102.87 30.48,99.97 C1.- 30.48,97.38 32.46,95.4 39.62,95.4 | 22.71,102.87 22.55,102.87 | 20.73,93.88 13.87,93.88 | 13.87,93.88 13.56,93.88 C3.2 13.87,93.88 | 20.73,93.88 21.49,93.12 C13.+ | 2.13,70.41 2.13,73.61 4.88,76.35 | 2.13,70.41 v2.13,69.65 2.13,68.58 R13.1 | 4.88,76.35 7.16,78.64 C4.- | 4.88,76.35 v5.33,76.35 | 6.55,79.4 7.16,78.79 C4.- | 6.55,79.4 2.9,83.06 2.9,83.97 IC2.1 | 2.13,70.41 4.27,70.41 7.92,74.07 14.02,74.07 C8.2 14.17,74.22 15.54,74.22 15.7,74.37 16,74.37 17.07,73.3 17.07,72.08 IC5.63 17.07,71.93 17.07,71.17 v16.76,70.87
  Top 0.152: 6.55,79.4 6.71,79.4 12.65,85.34 C2.- 12.8,85.5 13.87,86.56 13.87,93.88 | 6.55,79.4 C4.- | 22.71,102.87 22.71,95.86 20.73,93.88 | 22.55,102.87 U$2.GND1 | v13.87,52.88 15.24,52.88 C28.- 15.24,47.4 26.21,36.42 26.21,29.26 C5.2 26.36,29.11 27.28,29.11 29.72,26.67 v29.72,23.62
  Bottom 0.152: 35.66,65.53 35.66,65.68 37.34,67.36 IC9.5 | 35.66,65.53 35.66,61.87 C45.1 35.51,61.72 34.75,60.96 34.75,59.44 34.9,59.28 36.42,59.28 38.71,61.57 38.71,62.03 IC9.3 38.86,62.18 38.86,62.79 39.62,63.55 41.91,63.55 44.5,60.96 | C43.2 43.43,72.69 43.28,72.54 43.28,69.49 C39.2 43.28,69.34 v45.26,67.36 46.33,66.29 46.33,62.79 44.5,60.96 | R56.1 41.6,54.71 43.43,56.54 C44.2 43.43,59.89 44.5,60.96 | 22.55,62.94 23.47,62.03 IC3.4 23.62,62.18 24.69,62.18 IC3.3 | 22.55,62.94 21.64,63.86 C23.2 21.64,64.01 23.47,65.84 23.47,67.36 IC3.5 | v22.55,62.79 22.55,62.94 | v35.81,65.53 35.66,65.53 | C6.2 44.35,93.73 v39.93,93.73 39.17,93.73 38.1,94.79 U1.11 38.1,95.4 | 38.1,95.4 36.88,95.4 U1.10 | 38.86,89 39.32,89.46 39.32,90.07 U1.3 | 38.86,89 38.56,88.7 37.64,88.7 36.88,89.46 36.88,90.07 U1.5 | v43.59,76.2 41.6,74.22 41.6,73.76 R54.1 | v39.32,88.54 38.86,89 | 22.71,16.15 23.77,15.09 23.77,14.17 IC4.5 23.93,14.02 23.93,13.56 24.69,12.8 25.6,12.8 26.36,13.56 26.36,14.02 IC4.3 | 22.71,16.15 20.88,17.98 19.51,17.98 C15.2 | 25.15,20.27 23.93,20.27 IC4.10 | 29.87,18.14 27.58,18.14 26.52,19.2 | 29.87,18.14 30.94,18.14 C12.2 | 26.52,19.2 26.52,20.12 IC4.12 26.36,20.27 | 26.36,20.27 v26.36,22.1 | 26.36,20.27 25.15,20.27 | 25.15,20.27 IC4.11 | v47.24,13.56 47.24,21.79 48.62,23.16 48.62,24.08 JP38.1 | v26.06,18.75 26.52,19.2 | v22.86,16.31 22.71,16.15 | JP42.1 1.22,34.29 1.22,49.99 0.46,50.75 0.46,58.98 2.44,60.96 JP2.9 | C38.2 7.62,60.2 7.62,60.5 v8.69,61.57 8.99,61.87 8.99,66.9 9.45,67.36 IC10.5 | v13.26,64.77 15.09,66.6 15.09,67.82 C46.1 15.24,67.97 16.76,69.49 v16.76,70.87 | 12.5,56.39 12.65,56.54 12.65,63.4 12.5,63.55
  Bottom 0.152: 12.5,56.39 12.34,56.24 12.04,56.24 10.97,55.17 10.97,54.41 9.75,53.19 9.75,52.12 R59.1 | 12.5,63.55 11.58,63.55 10.82,62.79 10.82,62.18 IC10.3 | 12.5,56.39 v12.65,56.24 12.65,54.1 v13.87,52.88 | 12.5,63.55 v12.65,63.7 | v5.33,76.35 6.71,74.98 R50.1 | v2.13,69.65 3.35,68.43 3.35,65.53 2.59,64.77 JP2.3 | 29.87,18.14 29.87,23.47 v29.72,23.62 | U1.12 38.19,95.31 38.1,95.4
  pour Top (isolate 0.012): 0,108.97 50.04,108.97 50.04,0 0,0
  pour Bottom (isolate 0.012): 0,108.97 50.04,108.97 50.04,0 0,0
I2C_SCL  (via drill 0.3)
  Top 0.152: IC8.24 41.76,62.94 41,62.94 38.1,65.84 38.1,69.19 37.34,69.95 37.34,71.02 R40.1 37.19,71.17 35.05,73.3 v33.68,73.3 | v22.55,62.03 22.55,60.2 IC5.29 | v20.57,64.31 20.57,66.75 28.35,74.52 v32.46,74.52
  Bottom 0.152: v22.55,62.03 22.25,62.03 21.18,63.09 21.03,63.09 20.57,63.55 v20.57,64.31 | v33.68,73.3 v32.46,74.52
I2C_SDA  (via drill 0.3)
  Top 0.152: 37.34,68.58 37.34,65.99 40.54,62.79 40.54,62.64 40.84,62.33 41.76,62.33 IC8.23 | v23.01,58.98 23.01,60.05 IC5.30 | v25.15,60.2 26.67,61.72 v29.41,61.72 | v31.7,65.53 32.77,65.53 v32.92,65.68 | 37.34,68.58 v36.42,69.49 | 37.34,68.58 R41.1
  Bottom 0.152: v23.01,58.98 23.93,58.98 v25.15,60.2 | v29.41,61.72 29.41,63.25 v31.7,65.53 | v32.92,65.68 33.53,65.68 36.42,68.58 v36.42,69.49
I2S_LRCK
  Top 0.152: IC5.33 26.21,62.33 31.09,62.33 31.7,61.72 34.29,61.72 IC8.7 34.44,61.72 35.36,61.72 35.66,62.03 35.66,62.48 35.36,62.79 34.44,62.79 IC8.5
I2S_SCK  (via drill 0.3)
  Top 0.152: v31.55,62.64 31.39,62.79 IC5.34 | v32.92,64.16 34.29,64.16 IC8.3
  Bottom 0.152: v31.55,62.64 32.92,64.01 v32.92,64.16
I2S_SIN
  Top 0.152: IC5.35 26.21,63.25 32.46,63.25 33.38,62.33 34.29,62.33 IC8.6
I2S_SOUT
  Top 0.152: IC5.36 26.21,63.7 30.79,63.7 30.94,63.55 34.29,63.55 IC8.4
JTCK  (via drill 0.3)
  Top 0.152: v19.2,66.75 19.96,66.75 24.08,70.87 24.08,71.93 IC5.49 | v18.14,67.82 15.39,70.56 7.32,70.56 4.42,67.67 1.68,67.67 0.46,66.45 0.46,65.53 1.22,64.77 JP2.4
  Bottom 0.152: v18.14,67.82 v19.2,66.75
JTDI  (via drill 0.3)
  Top 0.152: v23.62,76.2 23.62,72.08 IC5.50 | v17.07,76.2 11.89,76.2 v11.73,76.05
  Bottom 0.152: v17.07,76.2 v23.62,76.2 | v11.73,76.05 9.91,76.05 8.69,77.27 2.29,77.27 0.46,75.44 0.46,63.09 1.22,62.33 JP2.8
JTDO  (via drill 0.3)
  Top 0.152: v4.12,71.02 7.47,74.37 10.82,74.37 12.04,75.59 19.05,75.59 21.03,73.61 21.03,72.08 IC5.55 | v1.07,58.83 1.07,60.05 0.46,60.66 0.46,62.64 1.22,63.4 JP2.6
  Bottom 0.152: v4.12,71.02 4.12,61.42 1.52,58.83 v1.07,58.83
JTMS  (via drill 0.3)
  Top 0.152: v30.48,69.8 29.57,68.89 26.21,68.89 IC5.46 | v14.63,78.64 10.97,78.64 4.12,71.78 v3.96,71.78 | JP2.2 v2.29,67.06
  Bottom 0.152: v30.48,69.8 30.48,74.98 27.74,77.72 15.54,77.72 v14.63,78.64 | v3.96,71.78 3.5,71.32 3.5,70.87 2.9,70.26 1.98,70.26 1.52,69.8 1.52,67.82 v2.29,67.06
LED_DATA  (via drill 0.3)
  Top 0.152: v20.12,69.34 20.12,71.93 IC5.57 | v14.63,48.01 14.63,47.4 25.45,36.58 25.45,28.5 26.52,27.43 28.5,27.43 29.11,26.82 29.11,24.38 28.35,23.62 IC11.14
  Bottom 0.152: v20.12,69.34 20.12,68.89 19.81,68.58 19.81,65.23 18.14,63.55 18.14,61.11 14.78,57.76 14.78,48.16 v14.63,48.01
LED_EN  (via drill 0.3)
  Top 0.152: v14.33,45.57 8.23,39.47 8.23,38.25 8.38,38.1 8.38,17.07 12.65,12.8 13.72,12.8 18.59,17.68 23.16,17.68 26.36,20.88 28.19,20.88 IC11.12 | v18.75,61.27 19.66,61.27 19.96,60.96 19.96,60.2 IC5.24
  Bottom 0.152: v14.33,45.57 14.33,46.94 17.37,49.99 17.37,59.89 v18.75,61.27
LED_REC  (via drill 0.3)
  Top 0.152: v17.53,74.98 17.53,72.08 IC5.62 | v31.09,89.46 31.09,88.7 42.67,77.11 42.67,70.71 v45.26,68.12 | v44.35,53.03 44.35,47.85 36.88,40.39 36.88,34.29 JP21.1
  Bottom 0.152: v17.53,74.98 14.02,78.49 14.02,78.79 24.69,89.46 v31.09,89.46 | v45.26,68.12 46.63,66.75 46.63,62.64 43.89,59.89 43.89,57.76 44.35,57.3 v44.35,53.03
LED_SCK  (via drill 0.3)
  Top 0.152: v20.57,58.67 20.57,60.05 IC5.25 | v22.86,49.38 v20.57,51.66 | v34.59,21.79 31.24,21.79 29.26,19.81 28.35,19.81 IC11.11
  Bottom 0.152: v20.57,51.66 v20.57,58.67 | v22.86,49.38 22.86,45.87 22.55,45.57 22.55,44.5 34.59,32.46 v34.59,21.79
LIN  (via drill 0.3)
  Top 0.152: v45.26,59.89 44.81,60.35 41.91,60.35 IC8.20
  Bottom 0.152: v45.26,59.89 45.26,59.28 46.94,57.61 C37.+
LOUT  (via drill 0.3)
  Top 0.152: v29.72,51.21 32.46,51.21 35.66,54.41 35.66,57.91 35.36,58.22 34.44,58.22 IC8.12 | v26.82,48.31 23.32,44.81 19.05,44.81 v18.9,44.96 | v10.82,49.99 v16.46,44.35 | v5.94,52.58 v5.94,51.36
  Bottom 0.152: v26.82,48.31 v29.72,51.21 | v18.9,44.96 17.07,44.96 v16.46,44.35 | v10.82,49.99 7.92,49.99 6.55,51.36 v5.94,51.36 | v5.94,52.58 4.88,52.58 2.59,54.86 C33.+
LOUT_JACK
  Bottom 0.152: R61.1 11.89,54.56 11.89,43.28 13.26,41.91 13.26,34.29 JP13.1
N$1
  Bottom 0.152: R21.2 31.09,24.69 31.09,19.96 36.73,14.33 36.73,14.02 JP9.1
N$2
  Bottom 0.152: R21.1 29.41,24.84 29.41,27.28 R22.1 29.26,27.43 27.28,27.43 R25.2 27.28,27.28 27.28,24.84 C10.1 27.28,24.69 27.58,24.38 27.58,20.27 IC4.13
N$3
  Top 0.152: IC5.6 14.33,67.21 10.82,67.21 9.75,66.14 8.99,66.14 Q3.X1
N$4
  Bottom 0.152: JP11.1 35.66,10.06 35.66,14.94 30.33,20.27 30.33,27.74 29.26,28.8 24.38,28.8 23.77,28.19 23.77,27.43 R24.2
N$5
  Bottom 0.152: 19.96,24.84 21.95,24.84 R23.1 22.1,24.69 22.55,24.23 22.55,20.27 IC4.9 | 19.96,27.28 21.95,27.28 R24.1 | 19.96,27.28 19.96,24.84 | 19.96,24.84 C11.1 | 19.96,27.28 R26.2
N$6
  Bottom 0.152: JP10.1 36.27,5.79 26.82,5.79 26.21,6.4 26.21,10.06 25.91,10.36 24.69,10.36 24.54,10.21 24.54,9.14 23.47,8.08 23.47,7.01 R39.2
N$7
  Top 0.152: IC8.25 41.91,63.55 46.94,63.55 Q4.X1
N$8
  Top 0.152: IC5.5 14.33,67.82 10.36,67.82 9.75,68.43 8.99,68.43 Q3.X2
N$9  (via drill 0.3)
  Top 0.152: v27.58,92.05 23.62,92.05 v5.79,74.22 | v6.4,62.48 2.9,58.98 2.9,25.6 v2.74,25.45 | v2.74,15.39 v2.74,22.1
  Bottom 0.152: v27.58,92.05 42.37,92.05 47.7,86.72 47.7,86.41 R1.1 | v5.79,74.22 5.79,71.63 6.4,71.02 v6.4,62.48 | v2.74,22.1 v2.74,25.45 | v2.74,15.39 2.74,12.8 1.37,11.43 JP46.1
N$10
  Bottom 0.152: JP8.1 16.31,5.79 23.62,5.79 24.08,6.25 24.08,7.16 25.3,8.38 25.3,9.45 R38.2
N$11
  Bottom 0.152: R34.2 28.96,7.01 27.13,7.01 R36.1 26.98,7.01 26.98,9.45 R38.1 27.13,9.6 27.74,9.6 | 27.74,9.6 28.96,9.6 C20.1 | 27.74,9.6 27.74,14.02 IC4.2
N$12
  Bottom 0.152: R2.2 44.04,83.82 | C7.1 44.04,86.41 46.02,86.41 R1.2 | 44.04,83.82 44.04,86.26 C7.1 | 44.04,83.82 R3.1 | U1.2 40.69,90.07 40.69,89.46 43.89,86.26 C7.1
N$13
  Top 0.152: IC5.47 26.21,69.34 26.98,69.34 28.19,70.56 28.19,71.02 C19.1
N$14
  Bottom 0.152: R32.2 21.95,54.56 21.95,40.54 13.26,31.85 JP7.1
N$15
  Bottom 0.152: 19.66,7.01 21.49,7.01 R39.1 | 19.66,7.01 19.66,9.45 C21.1 19.66,9.6 21.49,9.6 R37.1 21.64,9.6 22.55,10.52 22.55,14.02 IC4.6 | 19.66,7.01 R35.2
N$16  (via drill 0.3)
  Top 0.152: v41.6,77.42 41.6,76.5 42.37,75.74 42.37,68.73 43.13,67.97 v43.13,66.14 | v45.72,62.94 46.33,62.94 48.01,61.27 48.01,51.05 38.41,41.45 v38.41,35.97
  Bottom 0.152: v41.6,77.42 47.7,83.52 47.7,83.82 R2.1 | v43.13,66.14 43.13,65.53 v45.72,62.94 | v38.41,35.97 39.01,35.36 39.17,35.36 41,33.53 41,8.84 37.34,5.18 5.03,5.18 1.37,8.84 JP45.1
N$17
  Top 0.152: 43.13,57 43.13,57.3 42.82,57.61 41.91,57.61 IC8.16 | 43.13,57 43.13,56.84 42.37,56.08 42.37,54.71 C34.1 | 43.13,57 46.02,59.89 46.94,59.89 C35.+
N$18  (via drill 0.3)
  Top 0.152: v37.19,53.49 37.19,52.88 v37.64,52.43
  Bottom 0.152: 42.52,54.1 43.43,55.02 C44.1 | 42.52,54.1 42.22,53.8 40.69,53.8 39.93,54.56 R56.2 | v37.19,53.49 37.64,53.95 37.64,54.56 R55.1 | v37.64,52.43 47.85,42.22 48.62,42.22 49.23,42.82 49.23,43.59 48.16,44.65 48.01,44.65 44.96,47.7 44.96,52.27 | 44.96,52.27 46.94,54.25 C37.- | 42.52,54.1 44.35,52.27 44.96,52.27
N$19
  Top 0.152: IC5.31 23.62,60.05 23.62,58.83 21.79,57 20.42,57 19.36,55.93 C24.1
N$20  (via drill 0.3)
  Top 0.152: v46.33,47.09 46.33,38.41 38.1,30.18 38.1,28.8 37.34,28.04 35.81,28.04 v33.68,30.18 | v6.86,22.1 6.86,18.75 2.9,14.78 2.59,14.78 1.37,16 1.37,16.46 JP4.1
  Bottom 0.152: v46.33,47.09 48.62,49.38 48.62,84.43 48.31,84.73 47.24,84.73 47.09,84.58 47.09,83.36 46.63,82.91 45.41,82.91 36.88,74.37 36.88,73.15 36.12,72.39 36.12,71.17 R58.2 | v33.68,30.18 21.34,30.18 19.05,27.89 19.05,24.23 21.95,21.34 21.95,19.05 21.79,18.9 20.57,18.9 17.83,21.64 14.94,21.64 13.72,20.42 10.52,20.42 8.84,22.1 v6.86,22.1
N$21
  Bottom 0.152: JP5.1 2.74,4.88 37.49,4.88 42.98,10.36 42.98,33.07 42.52,33.53 42.52,34.59 33.83,43.28 33.83,54.1 35.97,56.24 35.97,57.15 R57.2
N$22
  Bottom 0.152: R53.1 37.8,73.61 39.78,73.61 R54.2 39.93,73.61 40.69,72.85 42.06,72.85 43.43,74.22 C43.1 43.43,74.52 46.33,74.52 46.94,75.13 C36.-
N$23
  Bottom 0.152: R52.2 8.53,72.39 8.53,74.83 R50.2 8.38,74.98 6.4,76.96 4.27,76.96 2.59,75.29 C41.-
N$24
  Bottom 0.152: R31.2 25.76,54.56 23.77,54.56 R32.1 23.77,54.71 23.77,57.15 | 23.77,57.15 C22.1 25.91,57.15 25.91,62.03 IC3.2 | 23.77,57.15 R33.1
N$25
  Bottom 0.152: 9.6,71.48 7.77,71.48 6.86,72.39 R52.1 | 9.6,71.48 10.52,72.39 C42.1 10.67,72.39 10.67,74.83 R48.2 | 9.6,71.48 10.67,70.41 10.67,67.51 IC10.6
N$26
  Bottom 0.152: JP16.1 36.58,19.05 33.98,21.64 33.98,21.95 34.29,22.25 34.29,32.31 22.25,44.35 22.25,49.53 22.86,50.14 22.86,55.17 22.1,55.93 22.1,57.15 R33.2
N$27  (via drill 0.3)
  Top 0.152: v23.47,48.77 22.1,48.77 v21.34,48.01 | v10.52,40.54 v15.24,40.54
  Bottom 0.152: v23.47,48.77 28.35,53.65 28.35,62.94 27.43,63.86 24.38,63.86 23.47,64.77 23.47,65.08 24.08,65.68 24.08,68.58 23.32,69.34 23.32,71.02 R29.2 | v21.34,48.01 21.34,46.63 v15.24,40.54 | v10.52,40.54 10.06,40.54 JP6.1
N$28
  Bottom 0.152: R62.2 12.34,77.42 12.34,74.98 R48.1 12.34,74.83 12.34,72.39 C42.2 12.19,72.39 12.04,72.24 12.04,67.51 IC10.7
N$29  (via drill 0.3)
  Top 0.152: v15.39,78.64 14.78,79.25 v13.26,79.25 | v12.65,69.65 8.38,69.65 7.62,68.89 7.62,68.12 7.92,67.82 9.91,67.82 10.21,67.51 10.21,67.06 9.75,66.6 7.77,66.6 7.62,66.45 7.62,61.72 4.57,58.67 4.57,43.74 v4.42,43.59 | v7.77,40.23 7.77,39.93 7.47,39.62 7.47,18.9 2.59,14.02 1.37,14.02 JP47.1
  Bottom 0.152: v15.39,78.64 16,78.03 29.57,78.03 32.31,80.77 35.81,80.77 38.86,83.82 R5.1 | v13.26,79.25 13.26,70.26 v12.65,69.65 | v7.77,40.23 v4.42,43.59
N$30
  Bottom 0.152: 24.99,73.61 24.99,71.17 R29.1 24.84,71.02 24.84,67.51 IC3.6 | C9.1 27.13,71.17 27.13,73.61 R27.2 26.98,73.61 24.99,73.61 | 24.99,73.61 R28.1
N$31
  Bottom 0.152: C33.- 2.59,51.82 2.74,51.97 7.92,51.97 R59.2 8.08,52.12 8.84,52.88 8.84,55.32 8.08,56.08 8.08,57.15 R51.2
N$32
  Bottom 0.152: 9.75,57.15 9.75,54.71 R49.2 | 9.75,57.15 C40.1 11.89,57.15 12.04,57.3 12.04,62.03 IC10.2 | 9.75,57.15 R51.1
N$33
  Bottom 0.152: R61.2 13.56,54.71 13.56,57.15 C40.2 13.41,57.15 13.41,62.03 IC10.1 13.26,62.18 13.26,63.86 12.8,64.31 11.12,64.31 10.21,63.4 10.21,61.11 7.16,58.06 7.16,56.54 7.92,55.78 7.92,54.71 R49.1
N$34
  Bottom 0.152: U1.14 U1.13
N$35  (via drill 0.3)
  Top 0.152: v22.25,74.07 22.25,76.05 26.98,80.77 36.12,80.77 v40.08,76.81 | v47.7,77.27 47.7,67.82 49.53,65.99 49.53,36.88 v38.1,25.45
  Bottom 0.152: v22.25,74.07 22.55,73.76 23.16,73.76 R28.2 | v40.08,76.81 42.98,76.81 43.43,77.27 v47.7,77.27 | v38.1,25.45 38.1,17.83 36.88,16.61 JP15.1
N$36
  Top 0.152: JP20.1 R15.1
N$37
  Top 0.152: R15.2 19.96,11.43 19.96,8.84 Q2.B
N$38  (via drill 0.3)
  Top 0.152: v39.01,84.89 39.01,81.23 42.98,77.27 42.98,74.07 v44.5,72.54 | v45.57,47.85 45.57,47.55 39.01,41 v39.01,34.75 | v46.63,12.04 v40.39,18.29
  Bottom 0.152: v39.01,84.89 39.01,86.26 R4.1 | v44.5,72.54 45.26,72.54 46.18,73.46 47.85,73.46 48.01,73.3 48.01,50.29 v45.57,47.85 | v39.01,34.75 39.01,19.66 v40.39,18.29 | v46.63,12.04 46.63,10.97 48.62,8.99 JP48.1
N$39
  Bottom 0.152: R5.2 35.2,83.82 | 35.66,86.41 37.19,86.41 R4.2 | 35.66,86.41 35.2,86.41 C47.1 35.2,86.26 35.2,83.82 | 35.2,83.82 R6.1 | 35.66,86.41 35.66,90.07 U1.6
N$42  (via drill 0.3)
  Top 0.152: v47.4,27.43 47.4,22.86 48.62,21.64 JP1.1
  Bottom 0.152: v47.4,27.43 46.33,27.43 45.41,28.35 45.41,38.86 36.42,47.85 36.42,51.97 38.56,54.1 38.56,54.86 39.17,55.47 40.08,55.47 41.45,56.84 41.45,57.15 R46.1
N$43
  Top 0.152: IC11.15 28.19,24.84 26.06,24.84 21.79,29.11 13.26,29.11 JP23.1
N$44
  Top 0.152: IC11.1 22.55,26.06 13.87,26.06 13.26,26.67 JP24.1
N$45
  Top 0.152: IC11.2 22.55,24.69 13.72,24.69 13.26,24.23 JP25.1
N$46
  Top 0.152: JP26.1 15.09,23.47 22.55,23.47 IC11.3
N$47
  Top 0.152: JP27.1 16.46,19.05 19.51,22.1 22.55,22.1 IC11.4
N$49  (via drill 0.3)
  Top 0.152: v47.24,46.48 47.24,37.8 v43.13,33.68
  Bottom 0.152: R7.1 40.84,99.06 49.53,90.37 49.53,48.77 v47.24,46.48 | v43.13,33.68 43.13,33.38 43.43,33.07 43.43,16.61 48.62,11.43 JP49.1
N$50  (via drill 0.3)
  Top 0.152: v40.23,100.13 40.23,96.16 44.04,92.35 44.04,83.21 v43.28,82.45 | v42.37,20.27 48.62,14.02 JP50.1
  Bottom 0.152: v40.23,100.13 40.23,101.5 R8.1 | v43.28,82.45 34.59,73.76 34.59,69.49 32.31,67.21 32.31,65.53 33.53,64.31 33.53,58.98 31.39,56.84 31.39,44.2 42.67,32.92 42.67,20.57 v42.37,20.27
N$51  (via drill 0.3)
  Top 0.152: v36.42,74.68 36.88,74.68 39.93,71.63 v39.93,69.04 | v11.43,31.7 12.8,33.07 v18.44,33.07 | v33.07,47.7 v25.6,40.23 | v38.1,64.47 v38.1,60.2
  Bottom 0.152: v36.42,74.68 36.12,74.37 36.12,73.76 R53.2 | v39.93,69.04 39.93,67.51 IC9.7 39.93,67.36 39.93,66.29 v38.1,64.47 | v11.43,31.7 8.99,29.26 1.37,29.26 JP18.1 | v25.6,40.23 v18.44,33.07 | v33.07,47.7 33.07,55.63 36.42,58.98 36.88,58.98 v38.1,60.2
N$52  (via drill 0.3)
  Top 0.152: v36.58,63.7 36.58,53.65 v34.44,51.51 | v26.67,37.19 v34.44,44.96
  Bottom 0.152: v36.58,63.7 37.95,65.08 38.25,65.08 39.32,66.14 39.32,69.19 41.15,71.02 41.45,71.02 R47.1 | v34.44,44.96 v34.44,51.51 | v26.67,37.19 17.07,27.58 17.07,22.4 16.61,21.95 14.63,21.95 13.72,22.86 6.1,22.86 2.29,26.67 JP3.1
N$53
  Top 0.152: IC11.5 22.55,20.88 18.75,20.88 14.48,16.61 13.26,16.61 JP28.1
N$54
  Bottom 0.152: 38.86,71.17 39.78,71.17 R47.2 | 38.86,71.17 37.8,71.17 R58.1 | 38.86,71.17 38.86,67.51 IC9.6
N$55
  Top 0.152: IC2.2 7.47,84.12 7.47,84.58 12.65,89.76 C2.+ 12.8,89.92 7.77,94.94 7.77,97.69 R11.2
N$56
  Bottom 0.152: IC9.1 41.15,62.03 40.69,61.57 40.69,56.54 40.39,56.24 37.64,56.24 36.12,54.71 R55.2 36.12,54.56 36.12,47.7 43.74,40.08 43.74,29.57 46.63,26.67 JP17.1
N$57
  Top 0.152: R12.1 30.94,11.43 31.85,12.34 35.81,12.34 36.73,11.43 JP19.1
N$58
  Bottom 0.152: R57.1 R46.2 39.93,57.15 39.93,62.03 IC9.2
N$59
  Top 0.152: IC8.26 41.91,64.31 48.16,64.31 48.31,64.47 48.31,65.08 47.55,65.84 47.09,65.84 Q4.X2
N$60
  Top 0.152: BR1.3 10.67,102.87 U$2.V+ 19.96,102.87 19.96,105.31 U$2.V++
N$61
  Top 0.152: BR1.4 10.67,105.46 18.44,105.46 19.51,106.53 28.96,106.53 30.02,105.46 U$2.V-- 30.18,105.31 30.18,102.87 U$2.V-
N$62
  Top 0.152: JP29.1 18.9,19.66 22.55,19.66 IC11.6
N$63
  Top 0.152: IC11.7 22.71,18.44 23.47,18.44 26.67,21.64 30.63,21.64 32.46,23.47 34.75,23.47 35.36,22.86 37.34,22.86 48.77,34.29 JP30.1
N$64
  Bottom 0.152: R7.2 36.42,99.06 | R8.2 38.41,101.65 36.42,101.65 R9.1 36.42,101.5 36.42,99.06 | 36.42,99.06 C48.1 36.27,99.06 35.66,98.45 35.66,95.4 U1.9
N$66
  Top 0.152: R12.2 32.61,11.43 32.61,8.84 Q1.B
PARAM_2  (via drill 0.3)
  Top 0.152: v24.69,65.68 23.62,66.75 22.55,66.75 21.64,65.84 21.64,60.2 IC5.27
  Bottom 0.152: v24.69,65.68 24.99,65.99 25.15,65.99 25.45,66.29 25.45,68.58 25.6,68.73 26.52,68.73 26.67,68.58 26.67,66.14 26.82,65.99 29.57,65.99 34.29,70.71 34.29,75.89 42.22,83.82 R3.2 42.37,83.82 42.37,86.26 C7.2 42.22,86.41 40.08,88.54 40.08,91.29 40.23,91.44 41.15,91.44 41.91,90.68 U1.1
PARAM_3  (via drill 0.3)
  Top 0.152: v16.31,65.38 14.48,65.38 IC5.10 | v21.64,73.46 21.64,75.89 28.65,82.91 v32.46,82.91
  Bottom 0.152: v16.31,65.38 16.31,66.9 21.64,72.24 v21.64,73.46 | v32.46,82.91 33.38,83.82 R6.2 33.53,83.82 33.53,86.26 C47.2 33.53,86.41 34.29,87.17 U1.7
PARAM_4  (via drill 0.3)
  Top 0.152: v18.75,70.1 18.75,67.06 16.46,64.77 14.48,64.77 IC5.11 | v33.53,94.49 v32.31,93.27
  Bottom 0.152: R9.2 34.75,101.5 34.75,99.06 C48.2 34.59,99.06 34.59,95.71 34.29,95.4 U1.8 34.29,95.25 v33.53,94.49 | v18.75,70.1 13.72,75.13 13.72,78.94 28.04,93.27 v32.31,93.27
PITCH_POT  (via drill 0.3)
  Top 0.152: v16.92,65.99 16.15,65.99 16,65.84 14.48,65.84 IC5.9 | v16.92,63.09 15.09,61.27 12.95,61.27 7.16,55.47 7.16,27.89 3.5,24.23 1.37,24.23 JP33.1
  Bottom 0.152: v16.92,63.09 v16.92,65.99
PLAY  (via drill 0.3)
  Top 0.152: 20.88,6.71 19.2,6.71 19.05,6.55 Q2.C | 20.88,6.71 22.86,6.71 R16.1 | v20.42,73.46 19.66,72.69 19.66,72.08 IC5.58 | v14.17,37.03 9.14,32 v9.14,18.9 | v20.27,12.5 20.88,11.89 20.88,6.71
  Bottom 0.152: v20.42,73.46 20.88,73.46 22.1,74.68 23.77,74.68 24.08,74.37 24.08,73 23.01,71.93 22.71,71.93 20.73,69.95 20.73,69.04 20.12,68.43 20.12,65.08 19.36,64.31 19.36,53.49 18.29,52.43 18.29,46.94 14.17,42.82 v14.17,37.03 | v9.14,18.9 12.8,15.24 17.53,15.24 v20.27,12.5
POSITION_POT_CV  (via drill 0.3)
  Top 0.152: v15.54,62.64 15.24,62.33 14.48,62.33 IC5.16 | v15.85,73.76 v15.85,72.24 | v26.06,74.37 v24.54,75.89 | v28.65,66.75 v28.65,65.38
  Bottom 0.152: v15.54,62.64 15.54,66.75 17.37,68.58 17.37,71.02 16.15,72.24 v15.85,72.24 | v15.85,73.76 17.37,73.76 19.2,75.59 24.23,75.59 v24.54,75.89 | v26.06,74.37 26.36,74.37 26.52,74.52 27.89,74.52 28.65,73.76 R27.1 28.8,73.61 28.8,71.17 C9.2 28.65,71.02 v28.65,66.75 | v28.65,65.38 26.98,65.38 26.06,66.29 26.06,67.36 IC3.7
POT_PARAM_1  (via drill 0.3)
  Top 0.152: v23.16,45.41 18.14,50.44 18.14,57 19.51,58.37 19.51,60.05 IC5.23
  Bottom 0.152: v23.16,45.41 23.16,44.5 35.66,32 35.66,27.74 36.73,26.67 JP34.1
REC  (via drill 0.3)
  Top 0.152: 30.02,9.6 30.02,9.14 28.04,7.16 28.04,6.86 R14.1 | 30.02,9.6 30.18,9.75 31.39,9.75 31.7,9.45 31.7,6.55 Q1.C | v20.73,68.28 20.42,68.28 19.51,69.19 19.51,70.1 19.05,70.56 19.05,71.93 IC5.59 | v25.3,47.7 v19.81,53.19 | v38.71,19.2 37.19,17.68 35.66,17.68 30.02,12.04 30.02,9.6
  Bottom 0.152: v20.73,68.28 20.73,65.23 19.81,64.31 v19.81,53.19 | v25.3,47.7 38.71,34.29 v38.71,19.2
RESET  (via drill 0.3)
  Top 0.152: 1.98,60.05 1.98,60.35 1.37,60.96 JP2.10 | 1.98,60.05 1.98,58.52 R17.1 | v7.01,68.73 8.53,70.26 15.09,70.26 15.24,70.1 15.24,67.06 15.09,66.9 14.48,66.9 IC5.7 | v7.01,64.31 2.74,60.05 1.98,60.05
  Bottom 0.152: v7.01,64.31 v7.01,68.73
RIN  (via drill 0.3)
  Top 0.152: v44.5,59.74 41.91,59.74 IC8.19
  Bottom 0.152: v44.5,59.74 44.5,60.05 46.94,62.48 46.94,71.93 C36.+
ROUT  (via drill 0.3)
  Top 0.152: v32.31,56.54 33.38,57.61 34.29,57.61 IC8.13 | v32.31,47.7 26.67,47.7 23.16,44.2 v19.66,44.2 | v11.43,41.91 v17.37,41.91
  Bottom 0.152: v32.31,47.7 v32.31,56.54 | v17.37,41.91 v19.66,44.2 | v11.43,41.91 9.75,41.91 1.22,50.44 1.22,58.06 4.57,61.42 4.57,70.71 4.72,70.87 4.72,71.78 4.12,72.39 2.9,72.39 2.59,72.08 C41.+
ROUT_JACK  (via drill 0.3)
  Top 0.152: v47.24,47.24 46.63,46.63 46.63,37.95 v46.02,37.34 | v46.02,28.5 46.02,19.2 48.62,16.61 JP12.1
  Bottom 0.152: v47.24,47.24 49.23,49.23 49.23,90.22 42.67,96.77 36.42,96.77 36.27,96.62 36.27,94.18 35.97,93.88 26.98,93.88 10.67,77.57 R62.1 | v46.02,28.5 v46.02,37.34
RX  (via drill 0.3)
  Top 0.152: v34.59,68.73 34.29,69.04 34.29,70.41 33.98,70.71 32.77,70.71 29.41,67.36 26.21,67.36 IC5.43 | v35.81,68.73 35.81,68.12 37.03,66.9 37.03,64.01 37.49,63.55 37.49,54.1 v38.41,53.19
  Bottom 0.152: v35.81,68.73 v34.59,68.73 | v38.41,53.19 48.31,43.28 U$4.2
SIZE_CV  (via drill 0.3)
  Top 0.152: v6.55,50.6 6.55,55.32 12.34,61.11 12.34,61.42 13.72,62.79 14.33,62.79 IC5.15 | v12.65,39.32 12.95,39.32 24.08,28.19 v24.54,28.19
  Bottom 0.152: v6.55,50.6 6.55,48.16 12.65,42.06 v12.65,39.32 | v24.54,28.19 25.45,27.28 R25.1 25.6,27.28 25.6,24.84 C10.2 25.6,24.69 26.98,23.32 26.98,19.2 27.28,18.9 28.04,18.9 28.96,19.81 IC4.14
SIZE_POT  (via drill 0.3)
  Top 0.152: v5.49,35.2 5.03,35.66 5.03,58.67 12.65,66.29 14.33,66.29 IC5.8 | v9.75,30.94 12.8,27.89 22.55,27.89 27.58,22.86 31.39,22.86 32.31,23.77 v35.2,23.77
  Bottom 0.152: v9.75,30.94 v5.49,35.2 | v35.2,23.77 35.2,23.16 36.73,21.64 JP31.1
SW_LOAD  (via drill 0.3)
  Top 0.152: v39.93,72.54 39.93,75.44 39.47,75.89 33.68,75.89 30.33,79.25 25.91,79.25 23.01,76.35 23.01,72.08 IC5.51 | v35.66,40.69 35.66,30.33 36.73,29.26 JP36.1
  Bottom 0.152: v39.93,72.54 37.64,72.54 36.88,71.78 36.88,69.8 37.03,69.65 37.03,68.73 33.83,65.53 33.83,58.83 31.7,56.69 31.7,44.65 v35.66,40.69
SW_MODE  (via drill 0.3)
  Top 0.152: v22.55,70.1 22.55,71.93 IC5.52 | v22.71,66.14 23.93,64.92 v24.08,64.92 | v27.28,64.77 27.89,64.16 v31.09,64.16 | v30.48,55.17 28.65,53.34 v28.65,53.19 | v42.06,24.38 42.06,24.69 45.41,28.04 45.41,28.65 45.87,29.11 48.62,29.11 JP35.1
  Bottom 0.152: v22.55,70.1 22.55,66.29 v22.71,66.14 | v24.08,64.92 27.13,64.92 v27.28,64.77 | v31.09,64.16 31.09,62.94 30.48,62.33 v30.48,55.17 | v28.65,53.19 29.87,51.97 30.02,51.97 30.48,51.51 30.48,48.77 30.18,48.46 30.18,44.96 42.06,33.07 v42.06,24.38
SW_REC  (via drill 0.3)
  Top 0.152: v19.66,74.22 18.14,72.69 18.14,72.08 IC5.61 | v29.11,75.13 36.12,75.13 36.27,75.29 v39.32,75.29 | v46.33,47.85 39.62,41.15 39.62,34.59 36.88,31.85 JP22.1
  Bottom 0.152: v19.66,74.22 21.18,74.22 21.95,74.98 28.96,74.98 v29.11,75.13 | v39.32,75.29 41.91,75.29 43.43,76.81 47.4,76.81 47.55,76.66 47.85,76.66 48.31,76.2 48.31,49.84 v46.33,47.85
TEXTURE_CV  (via drill 0.3)
  Top 0.152: v16.15,63.25 14.48,63.25 IC5.14 | v14.02,48.62 14.02,47.55 21.95,39.62 v21.95,31.55
  Bottom 0.152: v16.15,63.25 16.15,61.27 14.48,59.59 14.48,49.07 v14.02,48.62 | v21.95,31.55 21.95,31.24 18.14,27.43 R26.1 18.29,27.28 18.29,24.84 C11.2 18.14,24.69 21.34,21.49 IC4.8
TEXTURE_POT
  Top 0.152: JP32.1 35.66,25.3 35.66,27.43 17.83,45.26 17.83,57.15 19.05,58.37 19.05,60.05 IC5.22
TX  (via drill 0.3)
  Top 0.152: v28.04,64.77 28.04,65.53 26.82,66.75 26.21,66.75 IC5.42 | v30.79,48.31 36.73,48.31 v40.39,44.65
  Bottom 0.152: v28.04,64.77 28.04,63.7 28.8,62.94 28.8,55.47 30.79,53.49 v30.79,48.31 | v40.39,44.65 40.69,44.65 44.65,40.69 48.16,40.69 U$4.1
V_OCT  (via drill 0.3)
  Top 0.152: v17.98,58.52 17.98,60.05 IC5.20 | v16.46,22.55 16.46,22.25 v17.68,21.03
  Bottom 0.152: R34.1 30.79,7.01 30.79,9.45 C20.2 30.63,9.6 30.63,12.34 28.96,14.02 IC4.1 28.96,14.94 25.6,18.29 20.73,18.29 17.98,21.03 v17.68,21.03 | v17.98,58.52 17.98,47.09 13.56,42.67 13.56,35.66 14.48,34.75 14.48,33.83 13.56,32.92 12.65,32.92 12.04,32.31 12.04,26.06 12.8,25.3 13.72,25.3 v16.46,22.55
VCC  (via drill 0.3)
  Top 0.152: BR1.1 4.72,105.31 5.94,104.09 5.94,102.26 5.03,101.35 5.03,97.84 R11.1 5.03,97.69 5.03,97.08 v5.79,96.32 | v33.38,96.01 38.41,101.04 45.41,101.04 46.63,99.82 IC7.3 | v31.85,94.49 30.48,93.12 C1.+ 30.48,87.17 | v41.45,70.1 41.45,76.2 30.48,87.17 | v9.6,75.59 10.52,75.59 12.95,78.03 21.34,78.03 30.48,87.17
  Bottom 0.152: 11.43,65.99 12.5,65.99 13.26,66.75 13.26,67.36 IC10.8 | 11.43,65.99 10.36,65.99 10.21,66.14 10.21,68.43 9.91,68.73 9.14,68.73 7.62,67.21 7.62,61.87 C38.1 | 41.45,67.67 43.13,67.67 C39.1 | 41.45,67.67 41.3,67.51 IC9.8 41.45,67.67 | v33.38,96.01 v31.85,94.49 30.02,96.32 v5.79,96.32 | v41.45,70.1 41.45,67.67 | 11.43,65.99 11.43,75.59 11.28,75.74 9.75,75.74 v9.6,75.59
VEE  (via drill 0.3)
  Top 0.152: v45.26,66.6 46.18,67.51 46.18,72.08 44.96,73.3 44.96,74.83 R30.1 44.96,74.98 44.96,76.05 45.72,76.81 45.72,81.08 48.46,83.82 48.46,100.13 43.89,104.7 32.31,104.7 30.18,106.83 10.21,106.83 7.62,104.24 | 7.62,104.24 9.3,102.56 9.3,102.26 14.02,97.54 21.49,97.54 C13.- | 7.62,104.24 5.79,106.07 3.5,106.07 3.5,104.7 4.57,103.63 4.57,103.02 BR1.2 4.57,102.87 1.07,99.36 v1.07,74.52 | v15.09,71.48 6.55,71.48 v5.79,70.71
  Bottom 0.152: C45.2 35.66,60.2 37.49,62.03 IC9.4 37.49,62.18 37.49,62.79 38.56,63.86 39.62,63.86 42.52,66.75 43.28,66.75 43.43,66.6 v45.26,66.6 | IC10.4 9.6,62.18 9.6,63.25 10.97,64.62 12.34,64.62 13.87,66.14 13.87,67.97 15.09,69.19 15.09,69.49 C46.2 15.09,69.65 v15.09,71.48 | v5.79,70.71 5.79,71.17 3.05,73.91 1.68,73.91 v1.07,74.52

## Text on the board
bNames: EITHER WAY | Mod by Codex-Modulex - 2019 - v1.1 | Original design by Olivier Gillet | µNIMBUS | CC-BY-SA 3.0 | /Volumes/Macintosh HD/Codex_Modulex/Codex-Modulex/web/images/Logo/Ultimo/logo.bmp